# Altium schematic sheet DC_load.SchDoc
size A; SheetNumber: 8; SheetTotal: 8
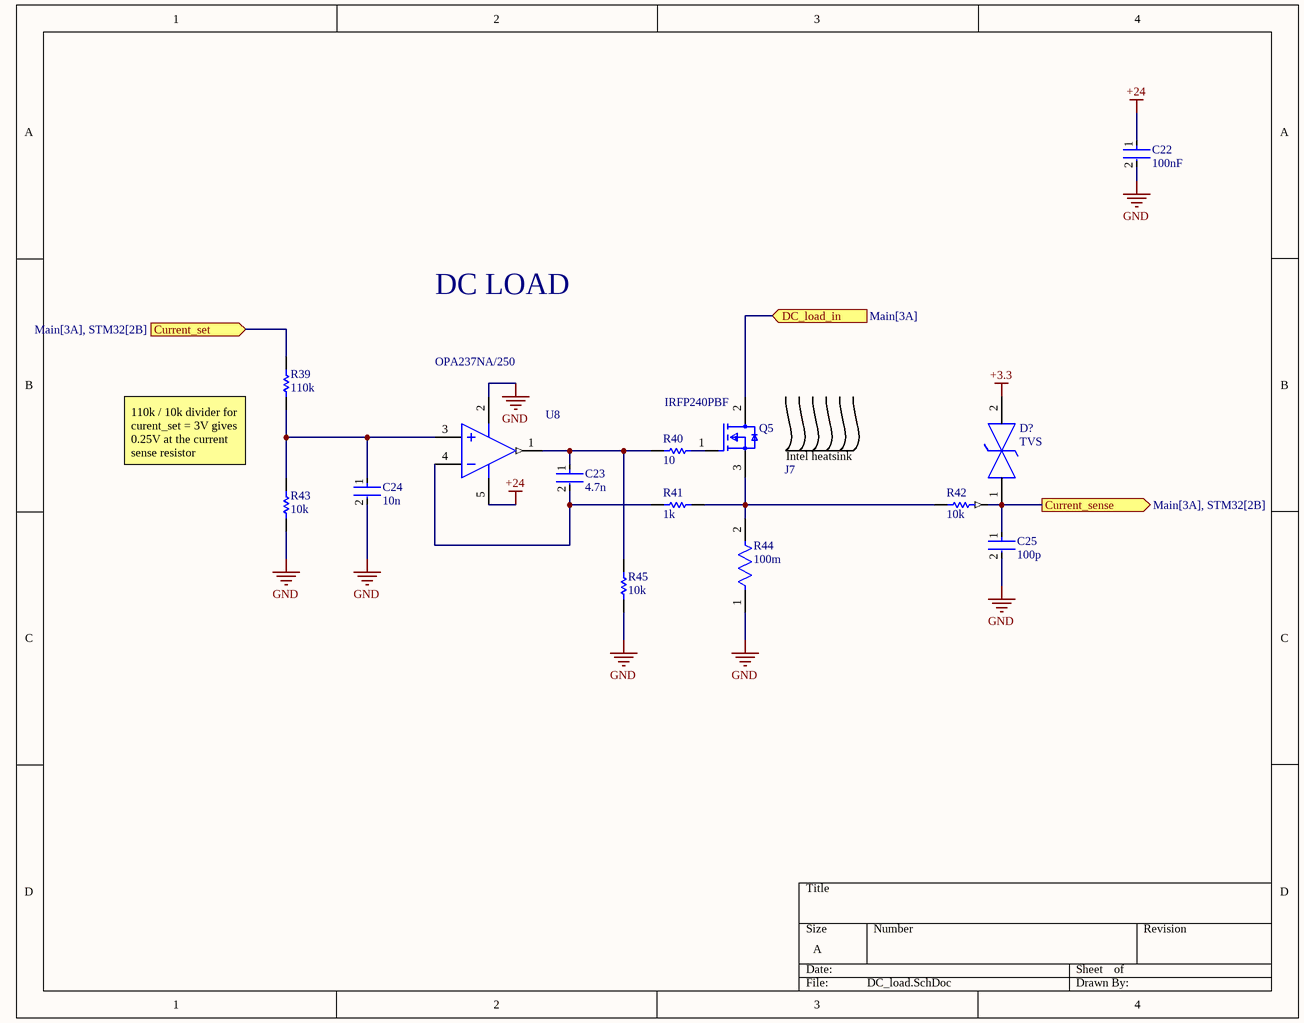
[diagram p0: DC_load.SchDoc]

## Parts
C22  100nF  [FP-0805-L_2_01_0_2-W_1_25-IPC_B]
C23  4.7n  [FP-0805-L_2_01_0_2-W_1_25-IPC_B]
C24  10n  [FP-0805-L_2_01_0_2-W_1_25-IPC_B]
C25  100p  [FP-0805-L_2_01_0_2-W_1_25-IPC_B]
D?  TVS  [FP-SMB-MFG]
J7  Intel heatsink  [Intel heatsink mount]  (value not drawn)
Q5  IRFP240PBF  [FP-E19-0614-MFG]
R39  110k  [RESC2013X50X30LL20T20]
R40  10  [RESC2013X50X30LL20T20]
R41  1k  [RESC2013X50X30LL20T20]
R42  10k  [RESC2013X50X30LL20T20]
R43  10k  [RESC2013X50X30LL20T20]
R44  100m  [FP-CRM2512-MFG]
R45  10k  [RESC2013X50X30LL20T20]
U8  OPA237NA/250  [DBV0005A_N]

## Ports
Current_sense (out, see Main[3A], STM32[2B]), Current_set (in, see Main[3A], STM32[2B]), DC_load_in (in, see Main[3A])

## Nets
+3.3: D?.2
+24: C22.1 U8.5(V+)
GND: C22.2 C24.2 C25.2 R43.1 R44.1 R45.1 U8.2(V-)
Current_sense: C25.1 D?.1 R42.1 ; port Current_sense
Current_set: R39.2 ; port Current_set
DC_load_in: Q5.2(D) ; port DC_load_in
NetC23_1: C23.1 R40.2 R45.2 U8.1(OUT)
NetC23_2: C23.2 R41.2 U8.4(IN-)
NetC24_1: C24.1 R39.1 R43.2 U8.3(IN+)
NetQ5_1: Q5.1(G) R40.1
NetQ5_3: Q5.3(S) R41.1 R42.2 R44.2

## Notes on the sheet
- DC LOAD
- 110k / 10k divider for curent_set = 3V gives 0.25V at the current sense resistor

## Library data of the parts
C22-C25 = CMP-2007-04174-2: General Purpose Ceramic Capacitor, 0805, 100nF, 10%, X7R, 15%, 100V; Packaging: Tape and Reel; Min Operating Temperature: -55°C; Dielectric Material: Ceramic; Height: 1.4mm; Voltage Rating: 100V; Termination: SMD/SMT; Case Code (Imperial): 0805; Case Code (Metric): 2012; Case/Package: 0805; Construction: Flat; Radiation Hardening: No; Series: -; Dielectric: X7R; Package Quantity: 2000; Mount: Surface Mount; Capacitance: 100nF; Contact Plating: Tin; Voltage: 100V; Lead Free: Lead Free; Depth: 1.25mm; RoHS Compliant: Yes; Number of Pins: 2; Max Operating Temperature: 125°C; Length: 2.01mm; Voltage Rating (DC): 100V; Thickness: 0.055inch; REACH SVHC: No SVHC; Width: 0.049inch; Tolerance: 10%
D? = CMP-12225-000039-1: TVS DIODE 28.2V 59V SMB; Manufacturer Part Number: SM6T33CA; Manufacturer: STMicroelectronics; Max Junction Temp: +150°C; Standoff Height: 0.05mm; Direction: Bidirectional; Number Of Channels: 1; Reverse Standoff Voltage: 33V; Peak Pulse Current: 68A; Breakdown Voltage: 31.4V; Peak Pulse Power: 600W; Mouser Description: TVS Diodes - Transient Voltage Suppressors 600W 33V Bidirect; Device Class L1: Circuit Protection; Device Class L3: unset; Temperature Range Low: -55°C; Octopart: https://octopart.com/sm6t33ca-stmicroelectronics-55399331; Height: 2.65mm; Digikey Description: TVS DIODE 28.2V 59V SMB; Automotive: No; Category: Diode; Device Class L2: TVS Diodes; Temperature: -55°C to +150°C; ComponentLink2URL: https://www.st.com/resource/en/datasheet/sm6t.pdf; Lead Free: Yes; Clamping Voltage: 59V; RoHS: TRUE; Temperature Range High: +150°C; Package: SMB; ComponentLink2Description: Datasheet
Q5 = CMP-02550-000013-1: MOSFET N-CH 200V 20A TO-247AC; Manufacturer: Vishay; Threshold Vgs: 4V; Input Capacitace At Vds: 1300pF @ 25V; Threshold Vgs Min: 2V; Reverse Recovery Time: 300ns; Pulse Drain Current: 80A; Depletion Mode: False; Power Dissipation: 150W; Number Of Channels: 1; Turn Off Delay Time: 45ns; Gate Charge At Vgs: 70nC @ 10V; Turn On Delay Time: 14ns; Reverse Recovery Charge: 3400nC; Rthja Max: 40°C/W; Gate To Source Voltage: 20V; Drain To Source Resistance: 0.18Ω; Max Junction Temp: +150°C; Standoff Height: 3.71mm; Category: Trans; Device Class L1: Discrete Semiconductors; Continuous Drain Current: 20A; Manufacturer Part Number: IRFP240PBF; Technology: MOSFET; Temperature Range Low: -55°C; Device Class L3: MOSFETs; Octopart: https://octopart.com/irfp240pbf-vishay-46527395; RoHS: TRUE; Threshold Vgs Max: 4V; Max Forward Diode Voltage: 2V; Lead Free: Yes; Mouser Description: MOSFET N-Chan 200V 20 Amp; Temperature Range High: +150°C; ComponentLink2Description: Datasheet; Number Of N Channels: 1; Height: 25.11mm; Ipc Land Pattern Name: TO-220; Temperature: -55°C to +150°C; Device Class L2: Transistors; ComponentLink2URL: http://www.vishay.com/docs/91210/91210.pdf; Package: E19-0614; Drain To Source Voltage: 200V; Digikey Description: MOSFET N-CH 200V 20A TO-247AC; Automotive: No; Drain To Source Breakdown Voltage: 200V
R39-R43 R45 = CMP-2001-04896-1: Manufacturer: Vishay Dale; Part Number: CRCW08050000Z0EA
R44 = CMP-07231-000004-1: RES 0.1 OHM 1% 2W 2512; Manufacturer: Bourns; 3DS Part Number: 110-00004; Manufacturer Part Number: CRM2512-FX-R100ELF; Resistance: 100mΩ; Voltage: 1.349V; Temperature Coefficient: 100ppm/°C; Value: 100mΩ; Voltage Rating: 1349mV; ComponentLink2Description: Datasheet; Lead Free: Yes; RoHS: TRUE; Ipc Land Pattern Name: RESC630310X60; Temperature: -55°C to +155°C; Package: CRM2512; Temperature Range High: +155°C; Mouser Description: Thick Film Resistors 2watts 1% .1ohms 100 PPM 2512; Category: Res; Temperature Range Low: -55°C; Series: CRM2512; Device Class L3: Chip SMD Resistors; Composition: Thick Film; Height: 0.8mm; Device Class L2: Resistors; Automotive: No; Device Class L1: Passive Components; Octopart: https://octopart.com/crm2512-fx-r100elf-bourns-9081968; Digikey Description: RES 0.1 OHM 1% 2W 2512; Power Rating: 2W; ComponentLink2URL: https://www.bourns.com/docs/product-datasheets/crm.pdf?sfvrsn=580c66f6_5; Tolerance: 1%
U8 = CMP-0272-00854-3: Single-Supply Operational Amplifier MicroAmplifier(TM) Series, 2.7 to 36 V, -55 to 125 degC, 5-pin SOT23 (DBV5), Green (RoHS & no Sb/Br); Manufacturer: Texas Instruments; Total Supply Voltage(Max)(+5V is 5, +/-5V is 10): 36; Packing: SMALL T&R; CMRR(Min)(dB): 78; Vio (25C)(Max)(mV): 0.75; Total Supply Voltage(Min)(+5V is 5, +/-5V is 10): 2.7; Rating: Catalog; Slew Rate(Typ)(V/us): 0.5; Number of Channels: 1; GBW(Typ)(MHz): 1.4; Sub Family: High Supply Voltage Amplifier (>=30V), Low Power Amp (<=500uA), Low Supply Voltage Amplifier (<=2.7V), Precision Amplifier; IIB(Max)(pA): 40000; Iq per channel(Max)(mA): 0.35; Offset Drift(Typ)(uV/C): 2; DatasheetVersion: SBOS057A; PackageVersion: 4073253-4/K, 03/2006; ComponentLink1URL: http://www.ti.com/; ComponentLink2Description: Datasheet; ComponentLink3Description: Package Specification; PackageReference: DBV0005A; Mounting Technology: Surface Mount; ComponentLink3URL: http://www.ti.com/litv/pdf/mpds018i; PartNumber: OPA237NA/250; Eco-Plan: Green (RoHS & no Sb/Br); ComponentLink1Description: Manufacturer URL; PackageDescription: 5-Pin Plastic Small Outline, Body 1.6 x 2.9 mm, Pitch 0.95 mm; ComponentLink2URL: http://www.ti.com/lit/ds/symlink/opa237.pdf; Code_JEDEC: MO-178